# Altium schematic sheet BLOCK DIAGRAM.SchDoc
size A4; SheetNumber: 1; SheetTotal: 7
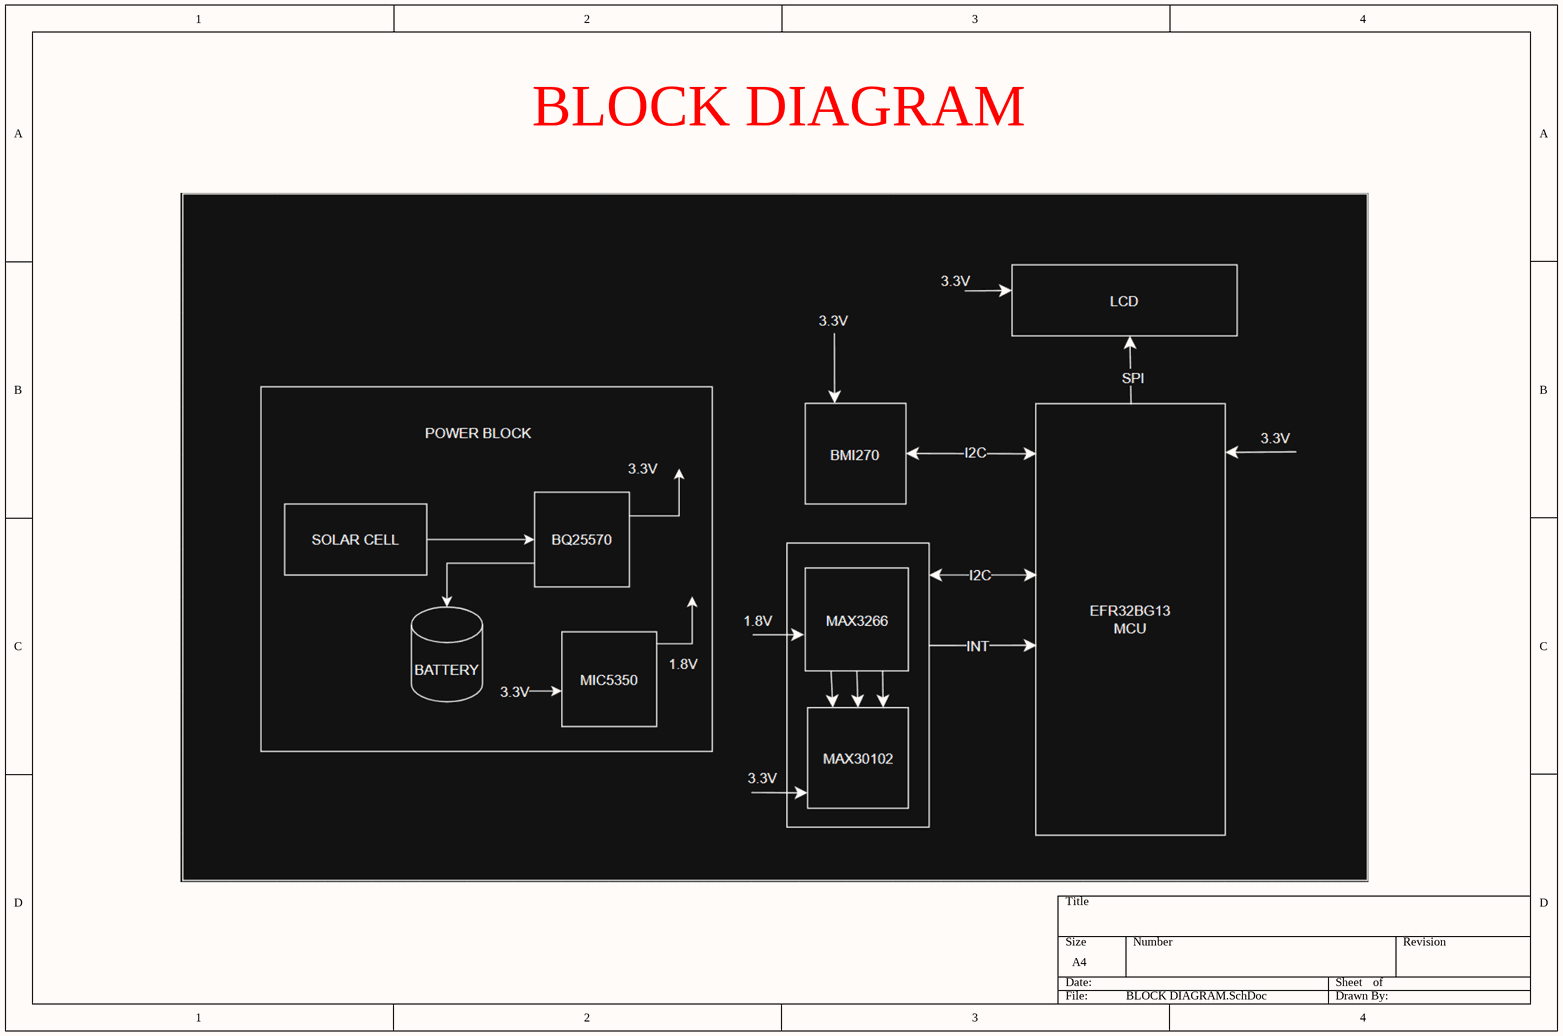
[diagram p0: BLOCK DIAGRAM.SchDoc]

## Notes on the sheet
- BLOCK DIAGRAM